# Altium schematic sheet PasaBajo(LP).SchDoc
size A4
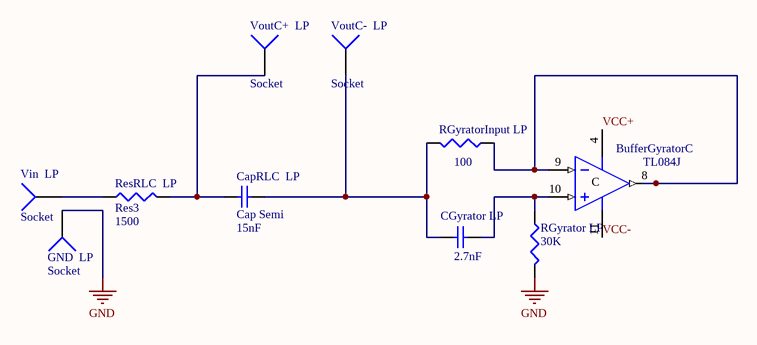
[diagram p0: PasaBajo(LP).SchDoc]

## Parts
BufferGyrator  TL084J  [J014]  (part C of 4)
CapRLC_LP  Cap Semi  value 15nF  [C0805]
CGyrator_LP  value 2.7nF  [C0805]  (hidden comment: Cap Semi)
GND_LP  Socket  [PIN1]
ResRLC_LP  Res3  value 1500  [6-0805_M]
RGyrator_LP  value 30K  [6-0805_M]  (hidden comment: Res3)
RGyratorInput_LP  value 100  [6-0805_M]  (hidden comment: Res3)
Vin_LP  Socket  [PIN1]
VoutC+_LP  Socket  [PIN1]
VoutC-_LP  Socket  [PIN1]

## Nets
GND: GND_LP.1 RGyrator_LP.2
VCC+: BufferGyrator.4(V+)
VCC-: BufferGyrator.11(V-)
NetBufferGyrator_8: BufferGyrator.8(OUT) BufferGyrator.9(IN-) RGyratorInput_LP.1
NetBufferGyrator_10: BufferGyrator.10(IN+) CGyrator_LP.1 RGyrator_LP.1
NetCapRLC_LP_1: CapRLC_LP.1 CGyrator_LP.2 RGyratorInput_LP.2 VoutC-_LP.1
NetCapRLC_LP_2: CapRLC_LP.2 ResRLC_LP.2 VoutC+_LP.1
NetResRLC_LP_1: ResRLC_LP.1 Vin_LP.1

## Notes on the sheet
- (in symbol TL084J, part C) C

## Library data of the parts
BufferGyrator = TL084J: JFET-Input Operational Amplifier; Published: 16-Jan-2001; LatestRevisionDate: 04-Mar-2005; LatestRevisionNote: Stylized 3D Model Added.; DatasheetVersion: Feb-1999; PackageVersion: Jun-1999; PackageReference: J014; Publisher: Altium Limited; PackageDescription: DIP; 14 Leads; Row Spacing 7.62 mm; Pitch 2.54 mm; ComponentLink1Description: Manufacturer Link; ComponentLink1URL: http://www.ti.com/; ComponentLink2Description: Datasheet; ComponentLink2URL: http://www-s.ti.com/sc/ds/tl084.pdf
CapRLC_LP CGyrator_LP = Cap Semi: Capacitor (Semiconductor SIM Model); Published: 8-Jun-2000; LatestRevisionDate: 29-May-2009; LatestRevisionNote: IPC-7351 Footprint Added.; PackageReference: C1206; Publisher: Altium Limited; PackageDescription: Chip Capacitor
ResRLC_LP RGyrator_LP RGyratorInput_LP = Res3: Resistor; Published: 8-Jun-2000; LatestRevisionDate: 29-May-2009; LatestRevisionNote: IPC-7351 Footprint Added.; PackageReference: J1-0603; Publisher: Altium Limited; PackageDescription: Chip Resistor
GND_LP Vin_LP VoutC+_LP VoutC-_LP = Socket: LatestRevisionDate: 17-Jul-2002; LatestRevisionNote: Re-released for DXP Platform.; Publisher: Altium Limited